# Altium schematic sheet LEDs.SchDoc
size A; SheetNumber: 5; SheetTotal: 10
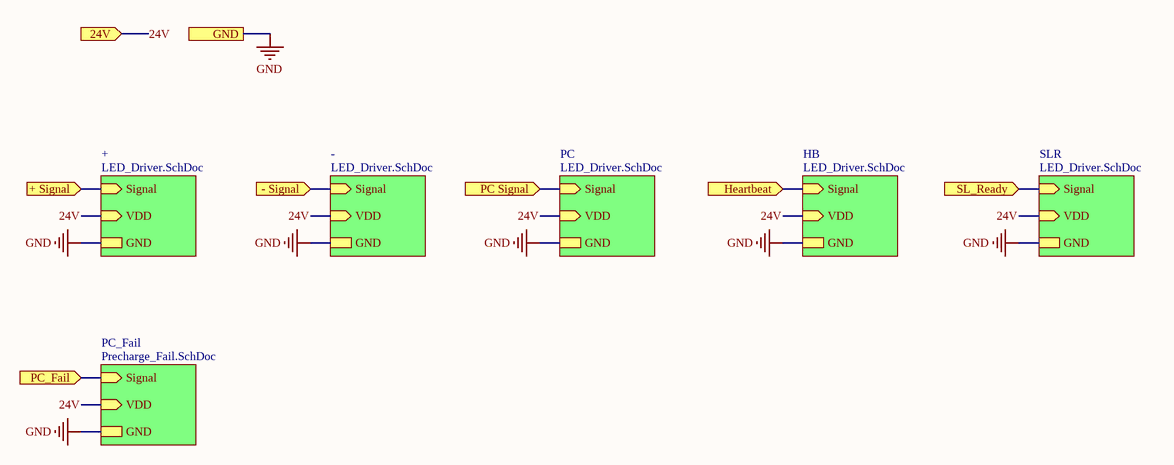
[diagram p0: LEDs.SchDoc]

## Sub-sheets
+ = LED_Driver.SchDoc: Signal (in), VDD (in), GND
- = LED_Driver.SchDoc: Signal (in), VDD (in), GND
HB = LED_Driver.SchDoc: Signal (in), VDD (in), GND
PC = LED_Driver.SchDoc: Signal (in), VDD (in), GND
PC_Fail = Precharge_Fail.SchDoc: Signal (in), VDD (in), GND
SLR = LED_Driver.SchDoc: Signal (in), VDD (in), GND

## Ports
24V (in), + Signal (in), - Signal (in), GND, Heartbeat (in), PC Signal (in), PC_Fail (in), SL_Ready (in)

## Nets
GND: port GND, sheet +/GND, sheet -/GND, sheet PC/GND, sheet HB/GND, sheet SLR/GND, sheet PC_Fail/GND
24V: port 24V, sheet +/VDD, sheet -/VDD, sheet PC/VDD, sheet HB/VDD, sheet SLR/VDD, sheet PC_Fail/VDD
+ Signal: port + Signal, sheet +/Signal
- Signal: port - Signal, sheet -/Signal
Heartbeat: port Heartbeat, sheet HB/Signal
PC Signal: port PC Signal, sheet PC/Signal
PC_Fail: port PC_Fail, sheet PC_Fail/Signal
SL_Ready: port SL_Ready, sheet SLR/Signal